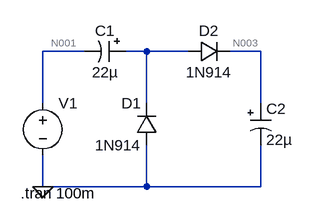
[diagram p0: schematic Voltage_Double.asc]
Voltage_Double.asc, the LTspice schematic file:
Version 4
SHEET 1 880 680
WIRE 128 144 64 144
WIRE 224 144 192 144
WIRE 288 144 224 144
WIRE 400 144 352 144
WIRE 64 224 64 144
WIRE 224 224 224 144
WIRE 400 224 400 144
WIRE 64 352 64 304
WIRE 224 352 224 288
WIRE 224 352 64 352
WIRE 400 352 400 288
WIRE 400 352 224 352
FLAG 64 352 0
SYMBOL voltage 64 208 R0
WINDOW 3 24 96 Invisible 2
WINDOW 123 0 0 Left 0
WINDOW 39 0 0 Left 0
SYMATTR InstName V1
SYMATTR Value SINE(0 5 1k)
SYMBOL polcap 192 128 R90
WINDOW 0 0 32 VBottom 2
WINDOW 3 32 32 VTop 2
SYMATTR InstName C1
SYMATTR Value 22µ
SYMATTR Description Capacitor
SYMATTR Type cap
SYMATTR SpiceLine V=2.5 Irms=3.72678 Rser=0.018 Lser=0
SYMBOL diode 240 288 R180
WINDOW 0 24 64 Left 2
WINDOW 3 24 0 Left 2
SYMATTR InstName D1
SYMATTR Value 1N914
SYMBOL diode 288 160 R270
WINDOW 0 32 32 VTop 2
WINDOW 3 0 32 VBottom 2
SYMATTR InstName D2
SYMATTR Value 1N914
SYMBOL polcap 384 224 R0
WINDOW 3 24 56 Left 2
SYMATTR InstName C2
SYMATTR Value 22µ
SYMATTR Description Capacitor
SYMATTR Type cap
SYMATTR SpiceLine V=6.3 Irms=4.08248 Rser=0.015 Lser=0
TEXT 30 362 Left 2 !.tran 100m

The netlist it stands for:
* Voltage_Double.asc
V1 N001 0 SINE(0 5 1k)
C1 N002 N001 22µ V=2.5 Irms=3.72678 Rser=0.018 Lser=0
D1 0 N002 1N914
D2 N002 N003 1N914
C2 N003 0 22µ V=6.3 Irms=4.08248 Rser=0.015 Lser=0
.model D D
.lib standard.dio
.tran 100m
.backanno
.end

* Results of the author's LTspice run, read from the files saved beside the schematic
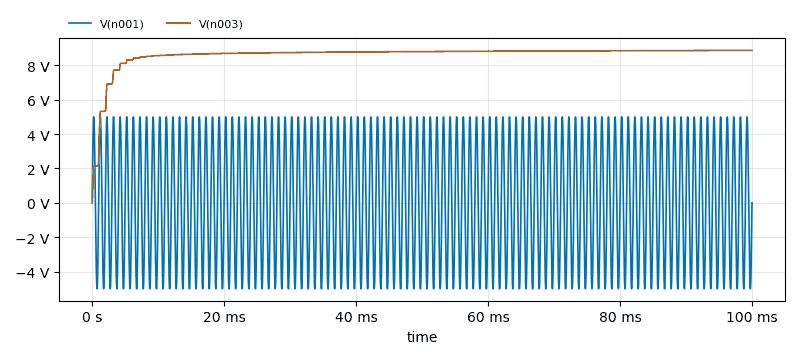
[diagram p1: Transient Analysis of Voltage_Double.asc, plotted from the saved traces]
* Transient Analysis, 1 run:
*   V(n001): min -5 V, max 5 V, average -4.199 mV, rms 3.592 V, last 0 V
*   V(n003): min 0 V, max 8.864 V, average 8.619 V, rms 8.658 V, last 8.864 V